# EAGLE schematic jackdemo (EAGLE 7.7.0)
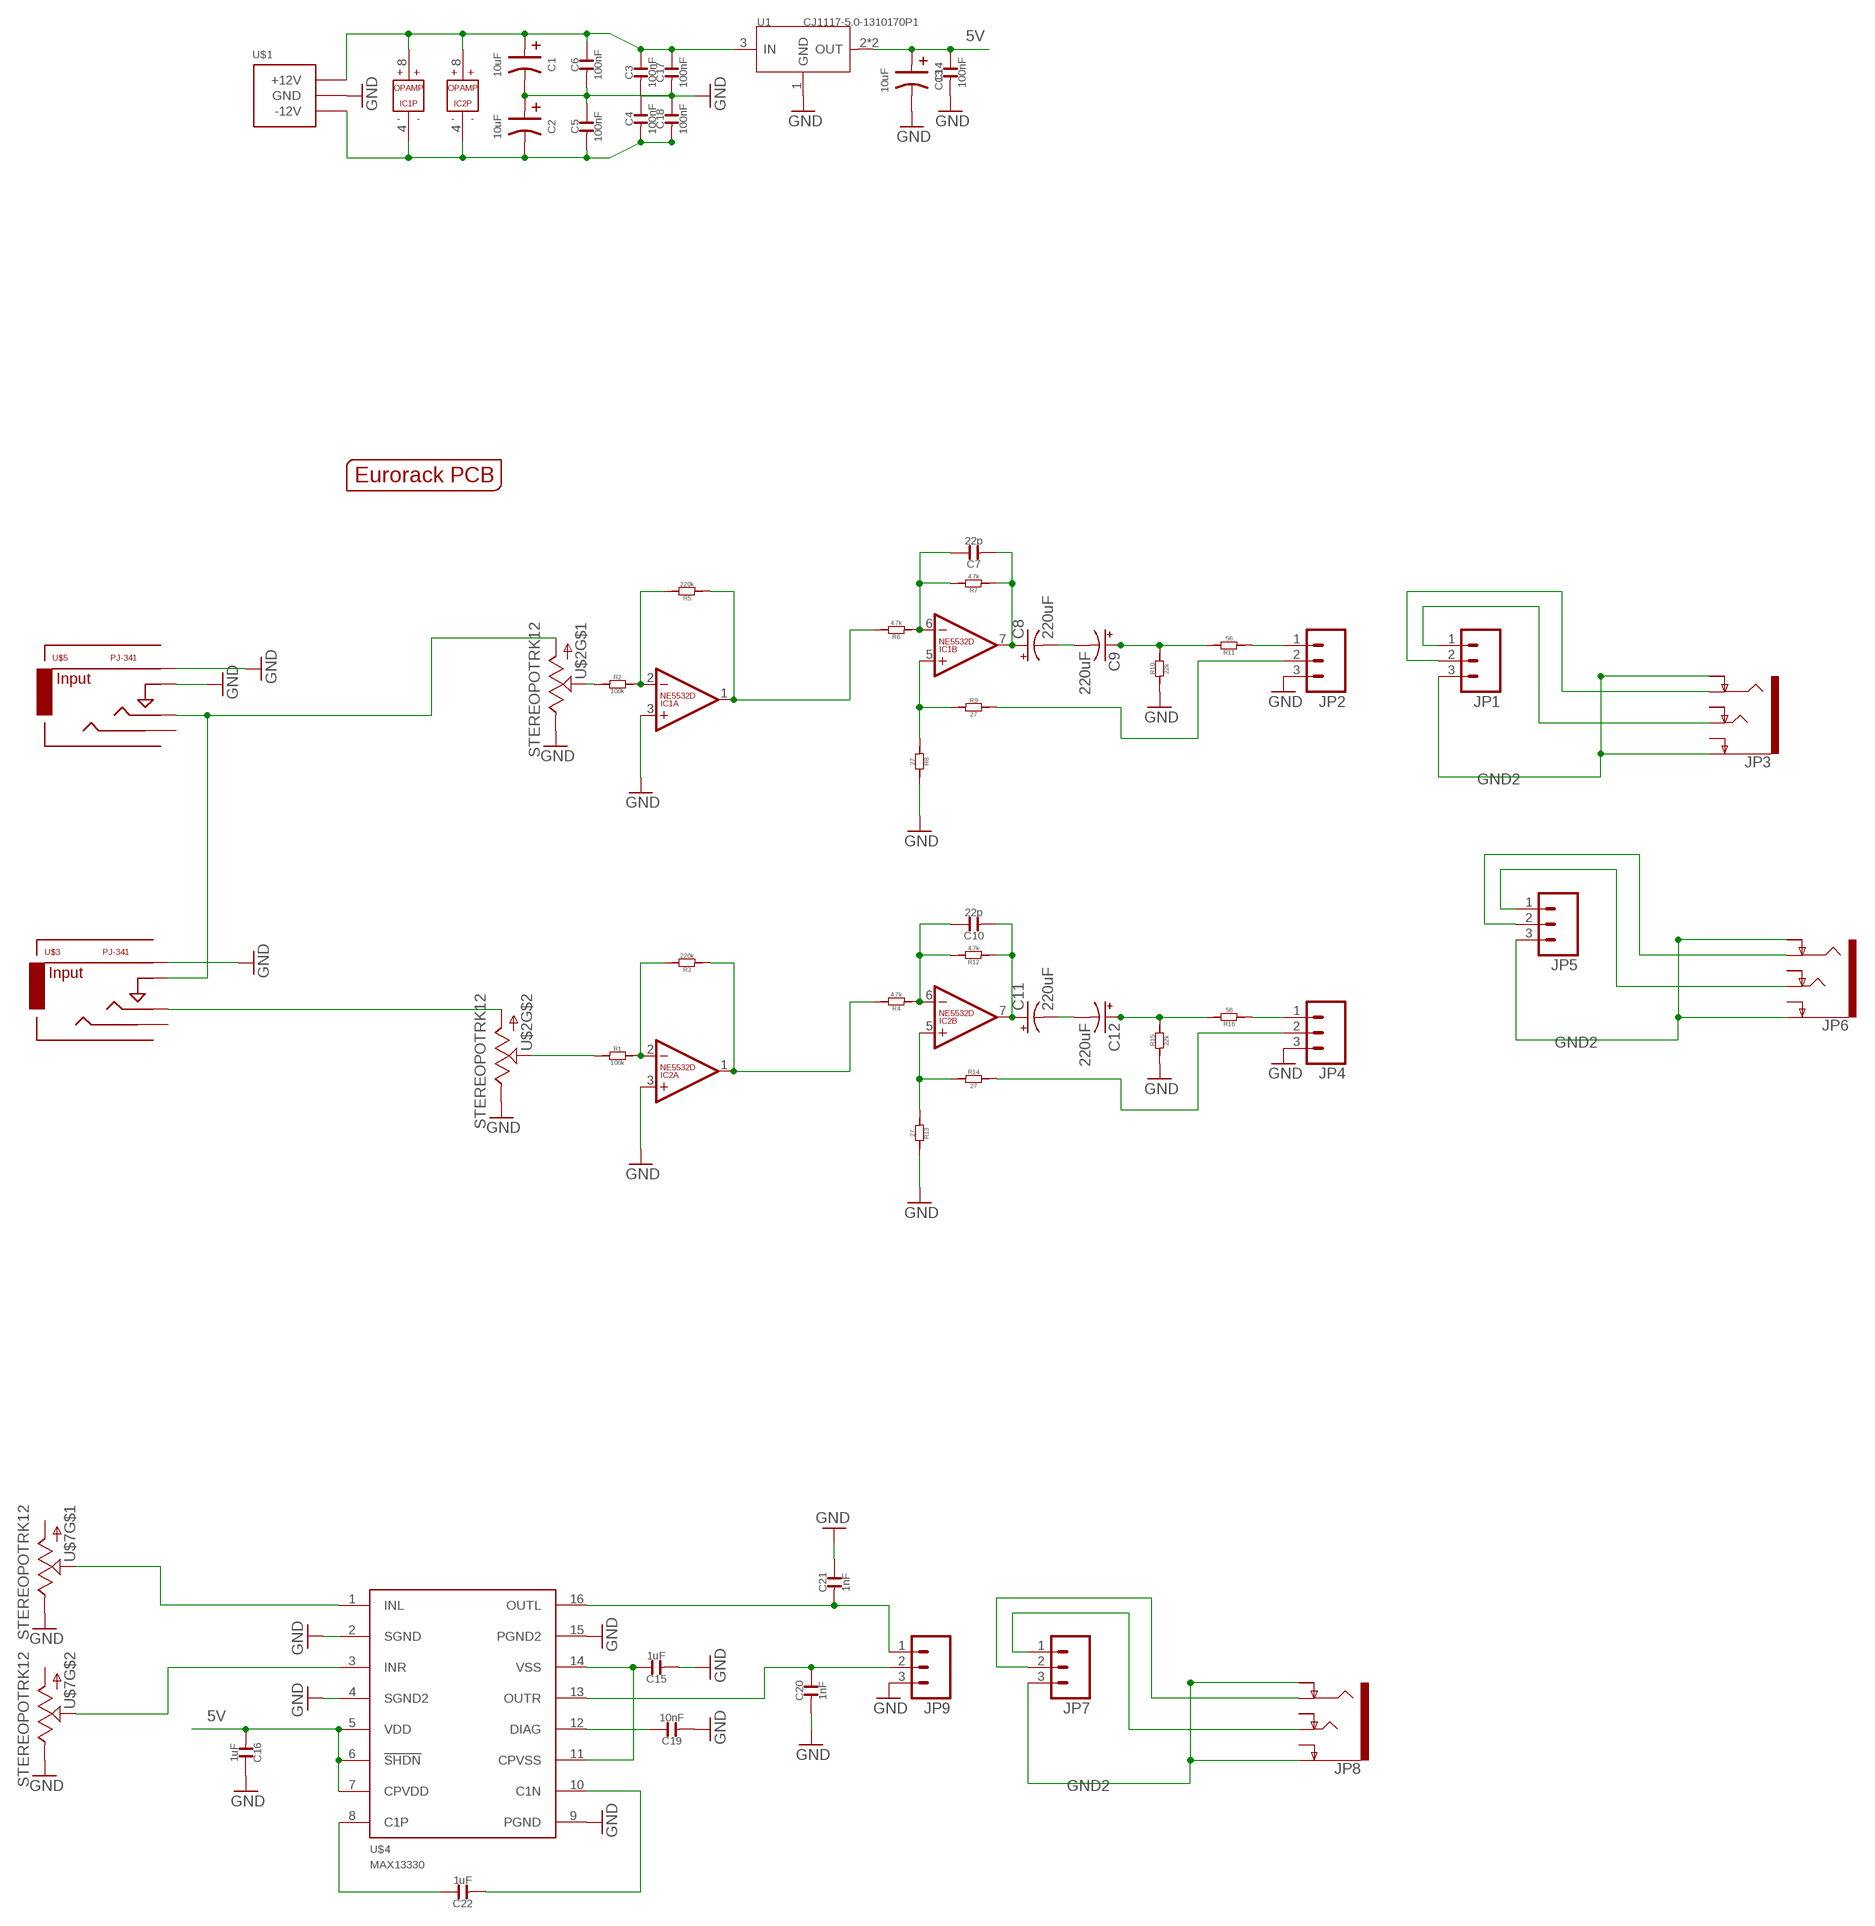
[diagram p0: schematic, sheet 1]

## Parts
C1  10uF  C-POLAR-A  [AVX-A]
C2  10uF  C-POLAR-A  [AVX-A]
C3  100nF  C-0603  [C0603]
C4  100nF  C-0603  [C0603]
C5  100nF  C-0603  [C0603]
C6  100nF  C-0603  [C0603]
C7  22p  C-0603  [C0603]
C8  220uF  CPOL-US153CLV-0505  [153CLV-0505]
C9  220uF  CPOL-US153CLV-0505  [153CLV-0505]
C10  22p  C-0603  [C0603]
C11  220uF  CPOL-US153CLV-0505  [153CLV-0505]
C12  220uF  CPOL-US153CLV-0505  [153CLV-0505]
C13  10uF  C-POLAR-A  [AVX-A]
C14  100nF  C-0603  [C0603]
C15  1uF  C-0603  [C0603]
C16  1uF  C-0603  [C0603]
C17  100nF  C-0603  [C0603]
C18  100nF  C-0603  [C0603]
C19  10nF  C-0603  [C0603]
C20  1nF  C-0603  [C0603]
C21  1nF  C-0603  [C0603]
C22  1uF  C-0603  [C0603]
IC1  NE5532D  [SO08]
IC2  NE5532D  [SO08]
JP1  M03PTH  [1X03]
JP2  M03PTH  [1X03]
JP3  AUDIO-JACK4-.25-HORIZ-TRS  [AUDIO-JACK-.25-INCH-HORIZ-PTH]
JP4  M03PTH  [1X03]
JP5  M03PTH  [1X03]
JP6  AUDIO-JACK4-.25-HORIZ-TRS  [AUDIO-JACK-.25-INCH-HORIZ-PTH]
JP7  M03PTH  [1X03]
JP8  AUDIO-JACK4-.25-HORIZ-TRS  [AUDIO-JACK-.25-INCH-HORIZ-PTH]
JP9  M03PTH  [1X03]
R1  100k  R-0603  [R0603]
R2  100k  R-0603  [R0603]
R3  220k  R-0603  [R0603]
R4  4.7k  R-0603  [R0603]
R5  220k  R-0603  [R0603]
R6  4.7k  R-0603  [R0603]
R7  4.7k  R-0603  [R0603]
R8  27  R-0603  [R0603]
R9  27  R-0603  [R0603]
R10  22k  R-0603  [R0603]
R11  56  R-0603  [R0603]
R12  4.7k  R-0603  [R0603]
R13  27  R-0603  [R0603]
R14  27  R-0603  [R0603]
R15  22k  R-0603  [R0603]
R16  56  R-0603  [R0603]
U1  CJ1117-5.0-1310170P1  [SOT223]
U$1  POWER_SIMPLE  [2X05_SMT_HEADER]
U$2  STEREOPOTRK12  [RK12]
U$3  PJ-341  AUDIO-JACKINPUT  [3.5MM-JACK-SWITCH-13MM-INPUT]
U$4  MAX13330  [QSOP16]
U$5  PJ-341  AUDIO-JACKINPUT  [3.5MM-JACK-SWITCH-13MM-INPUT]
U$6  EURORACK_PCB4HP  [EURORACK4HPPCB]
U$7  STEREOPOTRK12  [RK12]

## Nets
5V: C13.+ C14.2 C16.1 U1.2(OUT) U1.TER(OUT) U$4.5(VDD) U$4.6(!SHDN) U$4.7(CPVDD)
+12V: C1.+ C3.2 C6.2 C17.2 IC1.8(P:V+) IC2.8(P:V+) U1.3(IN) U$1.9(+12V) U$1.10(+12V)
-12V: C2.- C4.1 C5.1 C18.1 IC1.4(P:V-) IC2.4(P:V-) U$1.1(-12V) U$1.2(-12V)
GND: C1.- C2.+ C3.1 C4.2 C5.2 C6.1 C13.- C14.1 C15.1 C16.2 C17.1 C18.2 C19.1 C20.1 C21.2 IC1.3(A:+IN) IC2.3(A:+IN) JP2.3 JP4.3 JP9.3 R8.2 R10.1 R13.2 R15.1 U1.1(GND) U$1.3(GND) U$1.4(GND) U$1.5(GND) U$1.6(GND) U$1.7(GND) U$1.8(GND) U$2.R1_1(E) U$2.R2_1(E) U$3.RING@3(RING) U$4.2(SGND) U$4.4(SGND2) U$4.9(PGND) U$4.15(PGND2) U$5.RING@3(RING) U$5.SWITCH@3(SWITCH) U$7.R1_1(E) U$7.R2_1(E)
GND2: JP1.3 JP3.P$2(EARTH) JP3.P$5(RING-NORM) JP5.3 JP6.P$2(EARTH) JP6.P$5(RING-NORM) JP7.3 JP8.P$2(EARTH) JP8.P$5(RING-NORM)
N$1: JP2.1 R11.1
N$2: JP1.1 JP3.P$6(TIP)
N$3: C9.+ R10.2 R11.2
N$4: C7.1 C8.+ IC1.7(B:OUT) R7.1
N$5: IC1.5(B:+IN) R8.1 R9.1
N$6: JP2.2 R9.2
N$7: C7.2 IC1.6(B:-IN) R6.1 R7.2
N$8: IC1.2(A:-IN) R2.2 R5.2
N$9: JP4.1 R16.1
N$10: C12.+ R15.2 R16.2
N$11: C10.1 C11.+ IC2.7(B:OUT) R12.1
N$12: IC1.1(A:OUT) R5.1 R6.2
N$13: C8.- C9.-
N$14: R2.1 U$2.R1_2(S)
N$15: IC2.5(B:+IN) R13.1 R14.1
N$16: JP4.2 R14.2
N$17: C10.2 IC2.6(B:-IN) R4.1 R12.2
N$18: JP1.2 JP3.P$4(RING)
N$19: IC2.2(A:-IN) R1.2 R3.2
N$20: R1.1 U$2.R2_2(S)
N$21: IC2.1(A:OUT) R3.1 R4.2
N$22: C11.- C12.-
N$23: U$2.R1_3(A) U$3.SWITCH@3(SWITCH) U$5.TIP@3(TIP)
N$24: U$2.R2_3(A) U$3.TIP@3(TIP)
N$25: JP5.1 JP6.P$6(TIP)
N$26: JP5.2 JP6.P$4(RING)
N$27: JP7.1 JP8.P$6(TIP)
N$28: JP7.2 JP8.P$4(RING)
N$29: C15.2 U$4.11(CPVSS) U$4.14(VSS)
N$30: C19.2 U$4.12(DIAG)
N$31: C21.1 JP9.1 U$4.16(OUTL)
N$32: C20.2 JP9.2 U$4.13(OUTR)
N$33: C22.2 U$4.8(C1P)
N$34: C22.1 U$4.10(C1N)
N$35: U$4.1(INL) U$7.R1_2(S)
N$36: U$4.3(INR) U$7.R2_2(S)
Unconnected: JP3.P$3(EARTH-NORM) JP3.P$7(TIP-NORM) JP6.P$3(EARTH-NORM) JP6.P$7(TIP-NORM) JP8.P$3(EARTH-NORM) JP8.P$7(TIP-NORM) U$3.SECOND@3(SECOND) U$5.SECOND@3(SECOND) U$7.R1_3(A) U$7.R2_3(A)

## Library data of the parts
C1 C2 C13 = EurorackModularParts:C-POLAR*
C3-C7 C10 C14-C22 = OPL:C*
C8 C9 C11 C12 = adafruit:CPOL-US: POLARIZED CAPACITOR, American symbol
IC1 IC2 = EurorackModularParts:NE5532: AUDIO AMPLIFIER
JP1 JP2 JP4 JP5 JP7 JP9 = SparkFun-Connectors:M03: Header 3 Standard 3-pin 0.1" header. Use with straight break away headers (SKU : PRT-00116), right angle break away headers (PRT-00553), swiss pins (PRT-00743), machine pins (PRT-00117), and female headers (PRT-00115). Molex polarized connector foot print use with SKU : PRT-08232 with associated crimp pins and housings.
JP3 JP6 JP8 = EurorackModularParts:AUDIO-JACK4-.25-HORIZ-TRS: 1/4" TRS jack, horizontal Production SKU: COM-11144 Footprint unproven - datasheet and part seem to be slightly different; PROD_ID: COM-11144
R1-R16 = OPL:R*
U1 = OPL:CJ1117-5.0
U$1 = EurorackModularParts:POWER_SIMPLE
U$2 U$7 = EurorackModularParts:STEREOPOT
U$3 U$5 = EurorackModularParts:AUDIO-JACK: Switching Mono 3.5mm Audio Jack from Erthenvar.; DESC: Input; MPN: PJ-341
U$4 = ld-components:MAX13330
U$6 = EurorackModularParts:EURORACK_PCB